# Altium schematic sheet schematic.SchDoc
size A
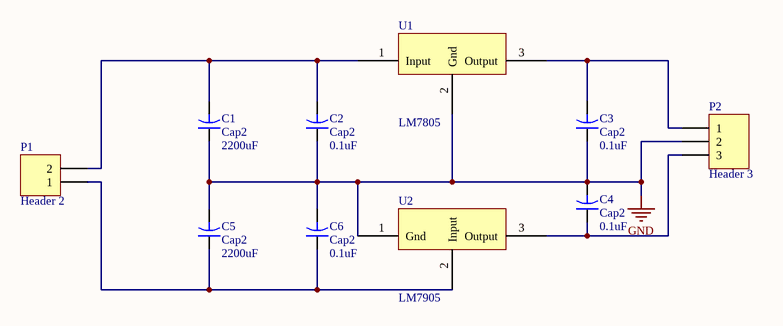
[diagram p0: schematic.SchDoc]

## Parts
C1  Cap2  value 2200uF  [CAPR5-4X5]
C2  Cap2  value 0.1uF  [CAPR5-4X5]
C3  Cap2  value 0.1uF  [CAPR5-4X5]
C4  Cap2  value 0.1uF  [CAPR5-4X5]
C5  Cap2  value 2200uF  [CAPR5-4X5]
C6  Cap2  value 0.1uF  [CAPR5-4X5]
P1  Header 2  [HDR1X2]
P2  Header 3  [HDR1X3]
U1  LM7805  [LM7805]
U2  LM7905  [LM7905]

## Nets
GND: C1.1 C2.1 C3.1 C4.2 C5.2 C6.2 P2.2 U1.2(Gnd) U2.1(Gnd)
NetC1_2: C1.2 C2.2 P1.2 U1.1(Input)
NetC3_2: C3.2 P2.1 U1.3(Output)
NetC4_1: C4.1 P2.3 U2.3(Output)
NetC5_1: C5.1 C6.1 P1.1 U2.2(Input)

## Library data of the parts
C1-C6 = Cap2: Capacitor; Published: 23-Sep-2002; PackageReference: CAPR5-4X5; Publisher: Altium Limited; PackageDescription: Capacitor; 2 Leads
P1 = Header 2: Header, 2-Pin; LatestRevisionDate: 17-Jul-2002; LatestRevisionNote: Re-released for DXP Platform.; Publisher: Altium Limited
P2 = Header 3: Header, 3-Pin; LatestRevisionDate: 17-Jul-2002; LatestRevisionNote: Re-released for DXP Platform.; Publisher: Altium Limited